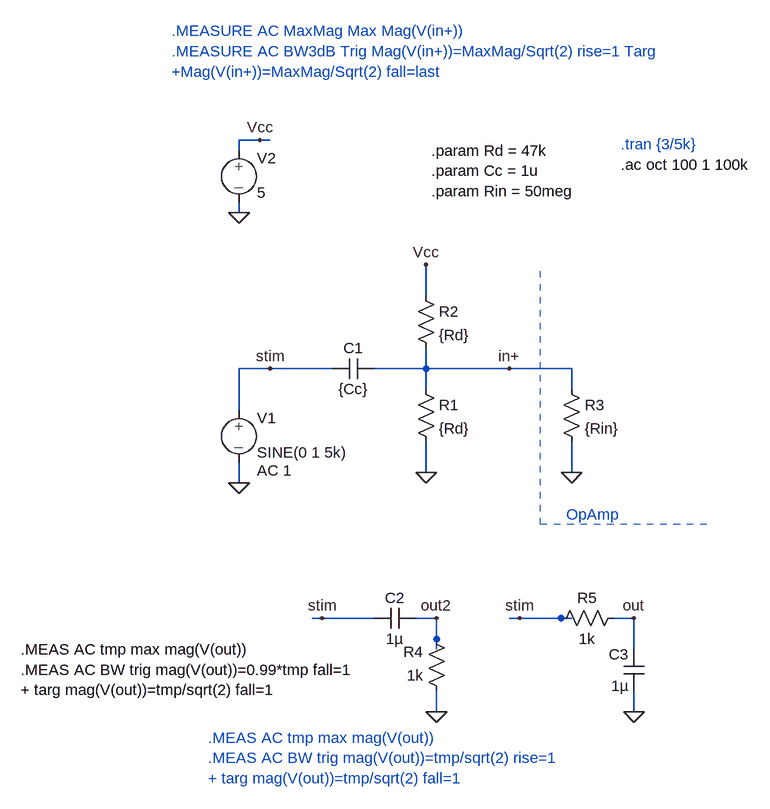
[diagram p0: schematic measure_ac_parameters.asc]
measure_ac_parameters.asc, the LTspice schematic file:
Version 4
SHEET 1 880 844
WIRE -32 -176 -64 -176
WIRE -16 -176 -32 -176
WIRE -64 -160 -64 -176
WIRE -64 -64 -64 -80
WIRE 224 64 224 16
WIRE -16 176 -64 176
WIRE 80 176 -16 176
WIRE 224 176 224 144
WIRE 224 176 144 176
WIRE 352 176 224 176
WIRE 448 176 352 176
WIRE 224 208 224 176
WIRE 448 208 448 176
WIRE -64 240 -64 176
WIRE 224 336 224 288
WIRE 448 336 448 288
WIRE -64 352 -64 320
WIRE 64 560 48 560
WIRE 144 560 64 560
WIRE 240 560 208 560
WIRE 368 560 352 560
WIRE 432 560 368 560
WIRE 448 560 432 560
WIRE 544 560 512 560
WIRE 240 592 240 560
WIRE 240 608 240 592
WIRE 544 608 544 560
WIRE 240 704 240 672
WIRE 544 704 544 672
FLAG -64 352 0
FLAG 224 336 0
FLAG -64 -64 0
FLAG -32 -176 Vcc
FLAG 224 16 Vcc
FLAG 448 336 0
FLAG 352 176 in+
FLAG -16 176 stim
FLAG 240 704 0
FLAG 64 560 stim
FLAG 240 560 out2
FLAG 544 704 0
FLAG 368 560 stim
FLAG 544 560 out
SYMBOL res 208 192 R0
SYMATTR InstName R1
SYMATTR Value {Rd}
SYMBOL res 208 48 R0
SYMATTR InstName R2
SYMATTR Value {Rd}
SYMBOL cap 144 160 R90
WINDOW 0 0 32 VBottom 2
WINDOW 3 32 32 VTop 2
SYMATTR InstName C1
SYMATTR Value {Cc}
SYMBOL source-V -64 224 R0
WINDOW 123 28 109 Left 2
WINDOW 39 0 0 Left 2
SYMATTR InstName V1
SYMATTR Value SINE(0 1 5k)
SYMATTR Value2 AC 1
SYMBOL source-V -64 -176 R0
WINDOW 123 0 0 Left 2
WINDOW 39 0 0 Left 2
SYMATTR InstName V2
SYMATTR Value 5
SYMBOL res 432 192 R0
SYMATTR InstName R3
SYMATTR Value {Rin}
SYMBOL res 256 688 R180
WINDOW 0 36 76 Left 2
WINDOW 3 36 40 Left 2
SYMATTR InstName R4
SYMATTR Value 1k
SYMBOL cap 208 544 R90
WINDOW 0 0 32 VBottom 2
WINDOW 3 32 32 VTop 2
SYMATTR InstName C2
SYMATTR Value 1µ
SYMBOL res 416 576 R270
WINDOW 0 32 56 VTop 2
WINDOW 3 0 56 VBottom 2
SYMATTR InstName R5
SYMATTR Value 1k
SYMBOL cap 560 672 R180
WINDOW 0 24 56 Left 2
WINDOW 3 24 8 Left 2
SYMATTR InstName C3
SYMATTR Value 1µ
TEXT 232 -160 Left 2 !.param Rd = 47k\n.param Cc = 1u\n.param Rin = 50meg
TEXT 440 400 Left 2 ;OpAmp
TEXT 524 -170 Left 2 ;.tran {3/5k}
TEXT 524 -138 Left 2 !.ac oct 100 1 100k
TEXT -168 -344 Left 2 ;.MEASURE AC MaxMag Max Mag(V(in+))\n.MEASURE AC BW3dB Trig Mag(V(in+))=MaxMag/Sqrt(2) rise=1 Targ \n+Mag(V(in+))=MaxMag/Sqrt(2) fall=last
TEXT -112 744 Left 2 ;.MEAS AC tmp max mag(V(out))\n.MEAS AC BW trig mag(V(out))=tmp/sqrt(2) rise=1\n+ targ mag(V(out))=tmp/sqrt(2) fall=1
TEXT -400 608 Left 2 !.MEAS AC tmp max mag(V(out))\n.MEAS AC BW trig mag(V(out))=0.99*tmp fall=1\n+ targ mag(V(out))=tmp/sqrt(2) fall=1
LINE Normal 400 416 400 16 2
LINE Normal 656 416 400 416 2

The netlist it stands for:
* measure_ac_parameters.asc
R1 in+ 0 {Rd}
R2 Vcc in+ {Rd}
C1 in+ stim {Cc}
V1 stim 0 SINE(0 1 5k) AC 1
V2 Vcc 0 5
R3 in+ 0 {Rin}
R4 0 out2 1k
C2 out2 stim 1µ
R5 stim out 1k
C3 0 out 1µ
.param Rd = 47k
.param Cc = 1u
.param Rin = 50meg
* OpAmp
* .tran {3/5k}
.ac oct 100 1 100k
* .MEASURE AC MaxMag Max Mag(V(in+))
* .MEASURE AC BW3dB Trig Mag(V(in+))=MaxMag/Sqrt(2) rise=1 Targ
* +Mag(V(in+))=MaxMag/Sqrt(2) fall=last
* .MEAS AC tmp max mag(V(out))
* .MEAS AC BW trig mag(V(out))=tmp/sqrt(2) rise=1
* + targ mag(V(out))=tmp/sqrt(2) fall=1
.MEAS AC tmp max mag(V(out))
.MEAS AC BW trig mag(V(out))=0.99*tmp fall=1
+ targ mag(V(out))=tmp/sqrt(2) fall=1
.backanno
.end